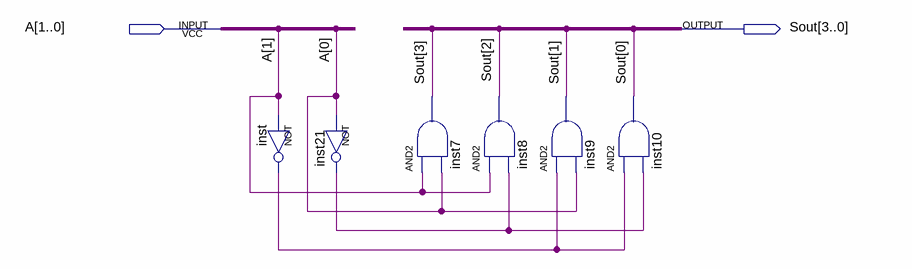
[diagram p0: schematic sheet]
// Quartus schematic Dec4.bdf as structural Verilog: 6 symbols, 2 pins
module Dec4 (
  input  [1:0] A,
  output [3:0] Sout
);

  wire inst21_out, inst_out;

  not inst (inst_out, A[1]);
  not inst21 (inst21_out, A[0]);
  and inst7 (Sout[3], A[1], A[0]);
  and inst8 (Sout[2], A[1], inst21_out);
  and inst9 (Sout[1], inst_out, A[0]);
  and inst10 (Sout[0], inst_out, inst21_out);
endmodule
